# EAGLE design PICDevBoard-V1RevA (EAGLE 6.1)
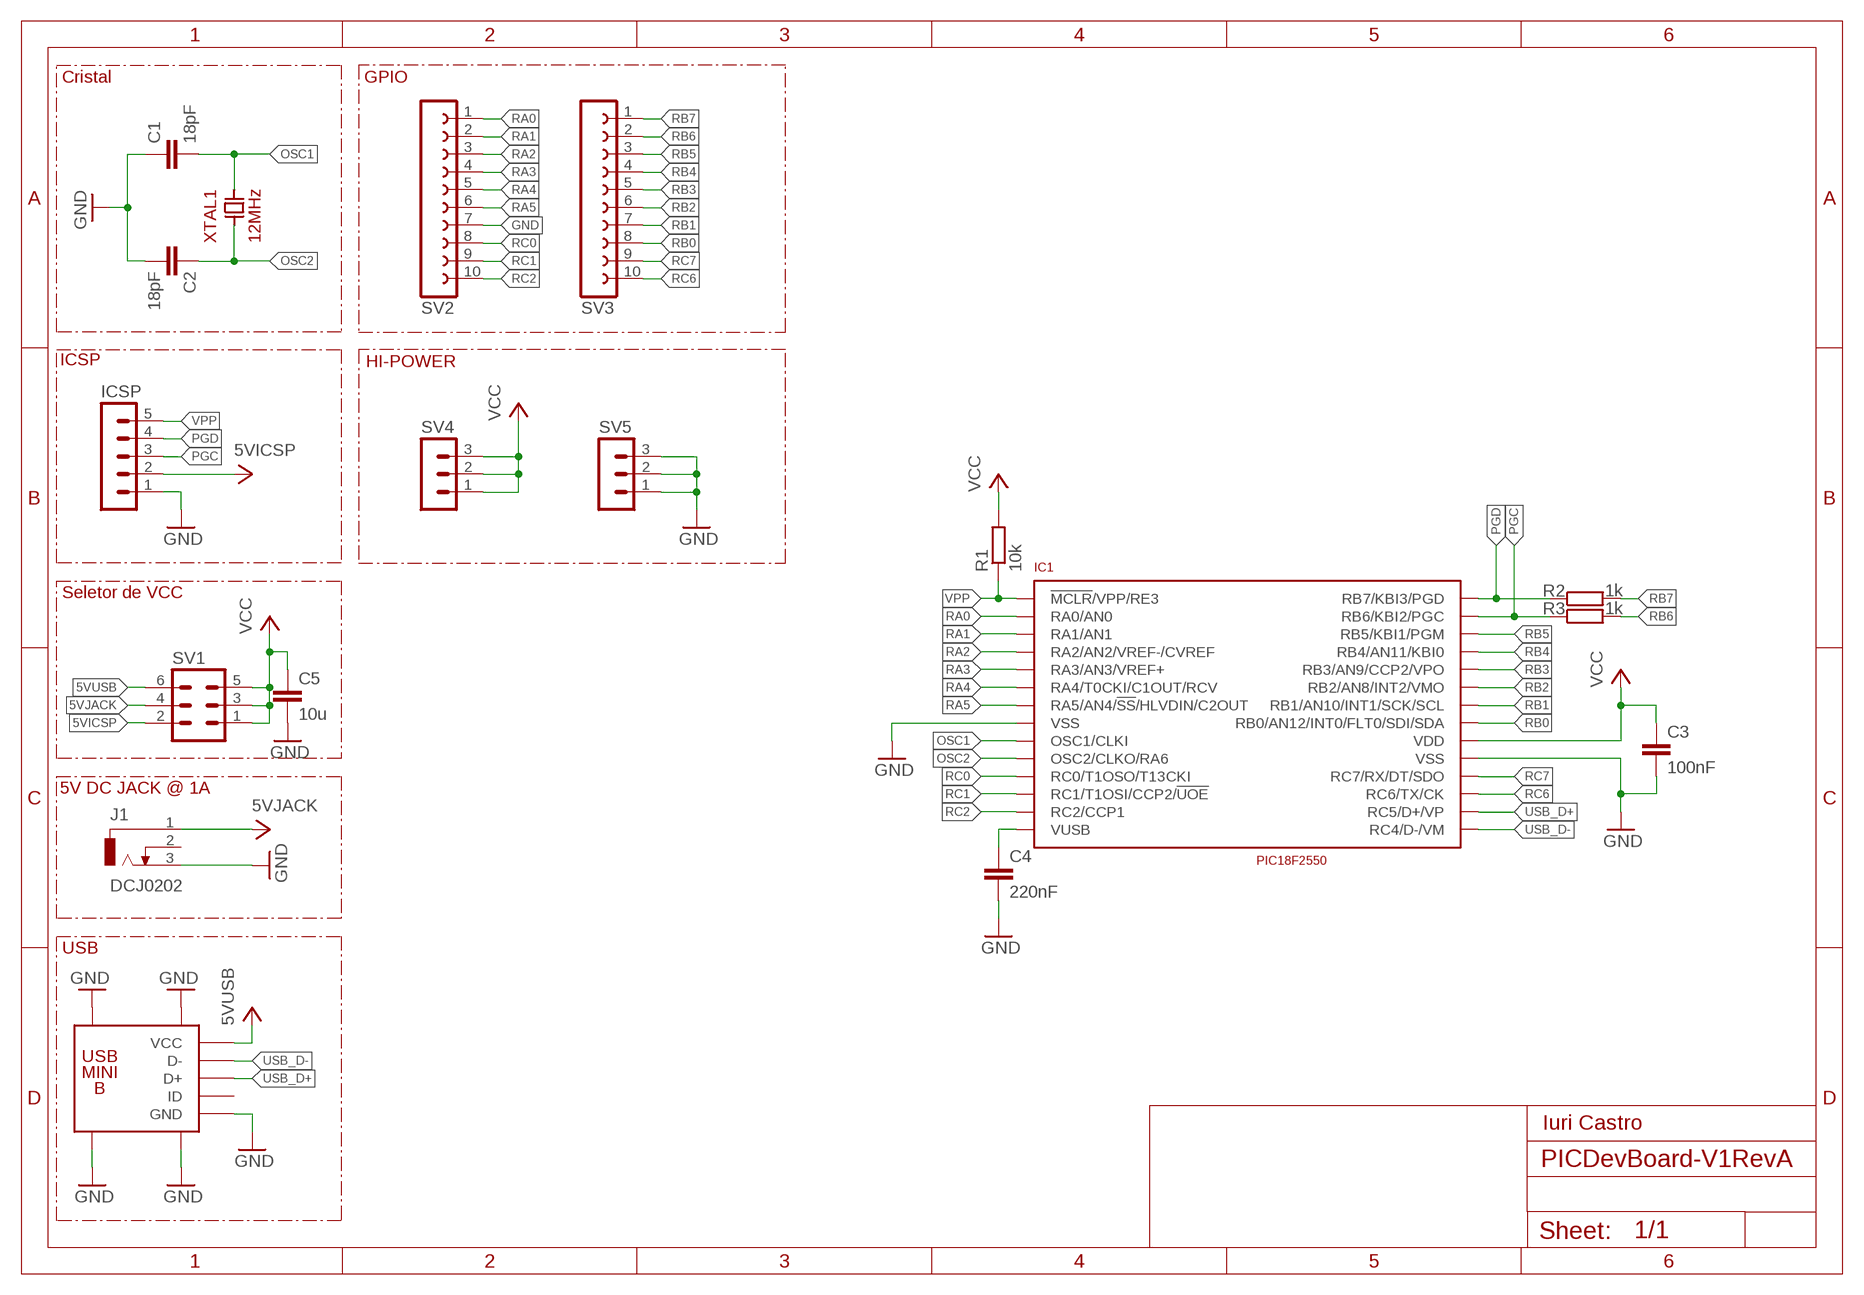
[diagram p0: schematic, sheet 1]

## Parts
C1  18pF  C-EUC0805  [C0805]
C2  18pF  C-EUC0805  [C0805]
C3  100nF  C-EUC0805  [C0805]
C4  220nF  C-EUC0805  [C0805]
C5  10u  C-EUC0805  [C0805]
IC1  PIC18F2550  [DIL28-3]
ICSP  MA05-1  [MA05-1]
J1  DCJ0202  [DCJ0202]
R1  10k  R-EU_R0805  [R0805]
R2  1k  R-EU_R0805  [R0805]
R3  1k  R-EU_R0805  [R0805]
SV1  MA03-2  [MA03-2]
SV2  FE10-1  [FE10]
SV3  FE10-1  [FE10]
SV4  MA03-1  [MA03-1]
SV5  MA03-1  [MA03-1]
USB1  USB-MINI-B  [DX2R005HN2E700]
XTAL1  12MHz  HC49-S  [HC49-S]

## Nets
5VICSP: ICSP.2 SV1.2
5VJACK: J1.1 SV1.4
5VUSB: SV1.6 USB1.P$1(VCC)
GND: C1.1 C2.2 C3.2 C4.2 C5.2 IC1.8(VSS) IC1.19(VSS) ICSP.1 J1.3 SV2.7 SV5.1 SV5.2 SV5.3 USB1.P$5(GND) USB1.P$6(GND) USB1.P$7(GND) USB1.P$8(GND) USB1.P$9(GND)
N$23: C4.1 IC1.14(VUSB)
OSC1: C1.2 IC1.9(OSC1/CLKI) XTAL1.P$2
OSC2: C2.1 IC1.10(OSC2/CLKO/RA6) XTAL1.P$1
PGC: IC1.27(RB6/KBI2/PGC) ICSP.3 R3.1
PGD: IC1.28(RB7/KBI3/PGD) ICSP.4 R2.1
RA0: IC1.2(RA0/AN0) SV2.1
RA1: IC1.3(RA1/AN1) SV2.2
RA2: IC1.4(RA2/AN2/VREF-/CVREF) SV2.3
RA3: IC1.5(RA3/AN3/VREF+) SV2.4
RA4: IC1.6(RA4/T0CKI/C1OUT/RCV) SV2.5
RA5: IC1.7(RA5/AN4/!SS!/HLVDIN/C2OUT) SV2.6
RB0: IC1.21(RB0/AN12/INT0/FLT0/SDI/SDA) SV3.8
RB1: IC1.22(RB1/AN10/INT1/SCK/SCL) SV3.7
RB2: IC1.23(RB2/AN8/INT2/VMO) SV3.6
RB3: IC1.24(RB3/AN9/CCP2/VPO) SV3.5
RB4: IC1.25(RB4/AN11/KBI0) SV3.4
RB5: IC1.26(RB5/KBI1/PGM) SV3.3
RB6: R3.2 SV3.2
RB7: R2.2 SV3.1
RC0: IC1.11(RC0/T1OSO/T13CKI) SV2.8
RC1: IC1.12(RC1/T1OSI/CCP2/!UOE) SV2.9
RC2: IC1.13(RC2/CCP1) SV2.10
RC6: IC1.17(RC6/TX/CK) SV3.10
RC7: IC1.18(RC7/RX/DT/SDO) SV3.9
USB_D+: IC1.16(RC5/D+/VP) USB1.P$3(D+)
USB_D-: IC1.15(RC4/D-/VM) USB1.P$2(D-)
VCC: C3.1 C5.1 IC1.20(VDD) R1.2 SV1.1 SV1.3 SV1.5 SV4.1 SV4.2 SV4.3
VPP: IC1.1(!MCLR!/VPP/RE3) ICSP.5 R1.1
Unconnected: J1.2 USB1.P$4(ID)

## Notes on the sheet
- Cristal | GPIO
- ICSP | HI-POWER
- Seletor de VCC
- 5V DC JACK @ 1A
- USB
- Iuri Castro

## Library data of the parts
C1-C5 = rcl:C-EU: CAPACITOR, European symbol
IC1 = PIC18F2550:PIC18F2550: PIC18F2550 Dip
ICSP = con-lstb:MA05-1: PIN HEADER; OC_FARNELL: unknown; OC_NEWARK: unknown
J1 = con-jack:DCJ0202: DC POWER JACK Source: DCJ0202.pdf; OC_FARNELL: unknown; OC_NEWARK: unknown
R1-R3 = rcl:R-EU_: RESISTOR, European symbol
SV1 = con-lstb:MA03-2: PIN HEADER; OC_FARNELL: unknown; OC_NEWARK: unknown
SV2 SV3 = con-lsta:FE10-1: FEMALE HEADER; OC_FARNELL: unknown; OC_NEWARK: unknown
SV4 SV5 = con-lstb:MA03-1: PIN HEADER; OC_FARNELL: unknown; OC_NEWARK: unknown
USB1 = USB:USB-MINI-B: CONN USB RCPT MINI B 5PS R/A SMD DX2R005HN2E700
XTAL1 = HC49-S:HC49-S: Crystal SMD

## Board
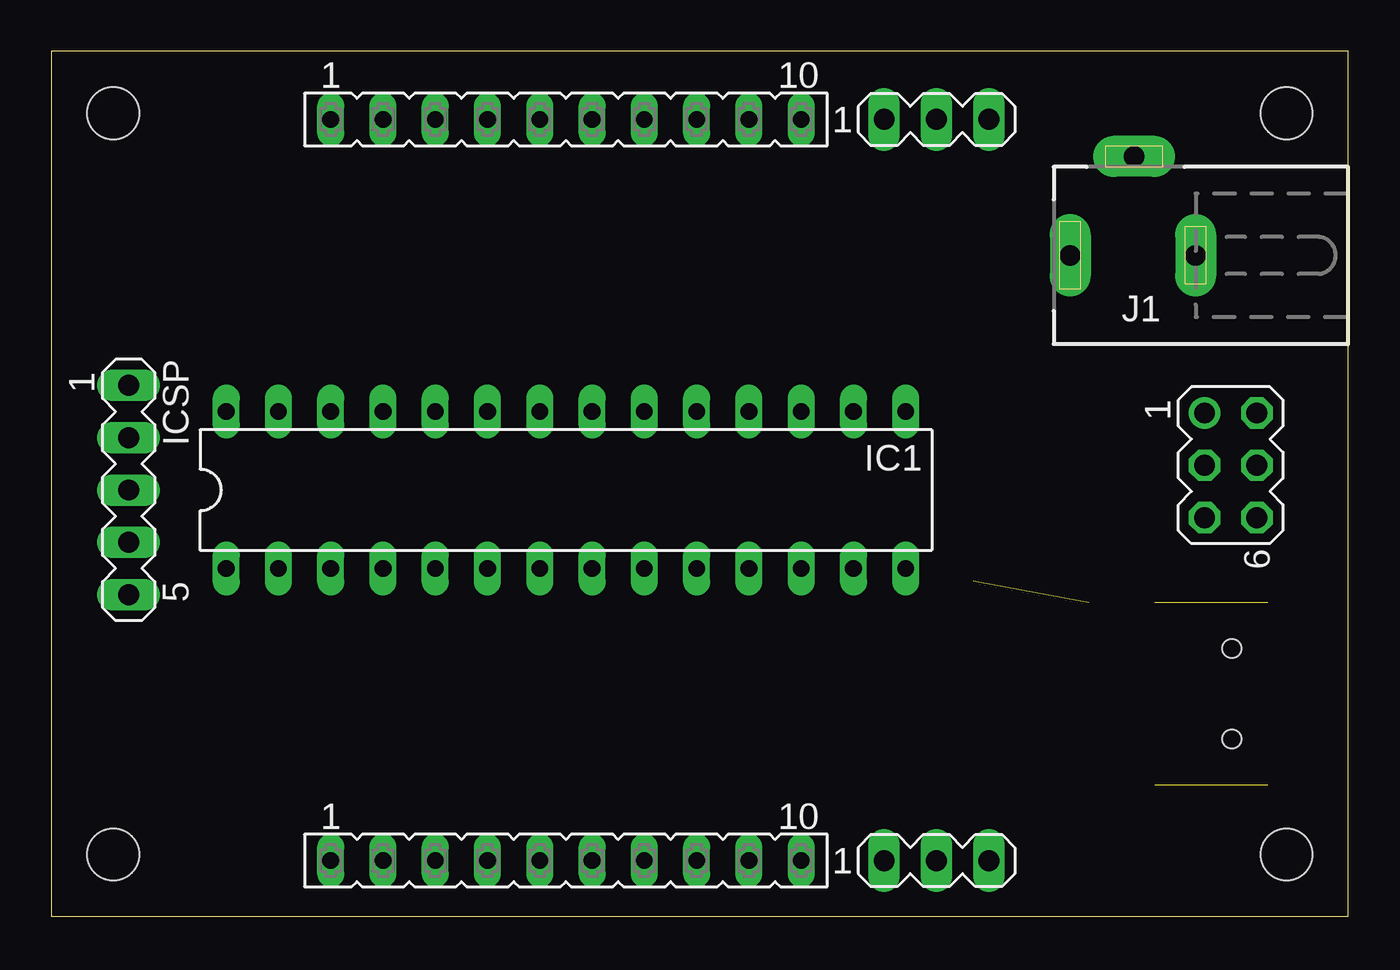
[diagram p1: board, top side]
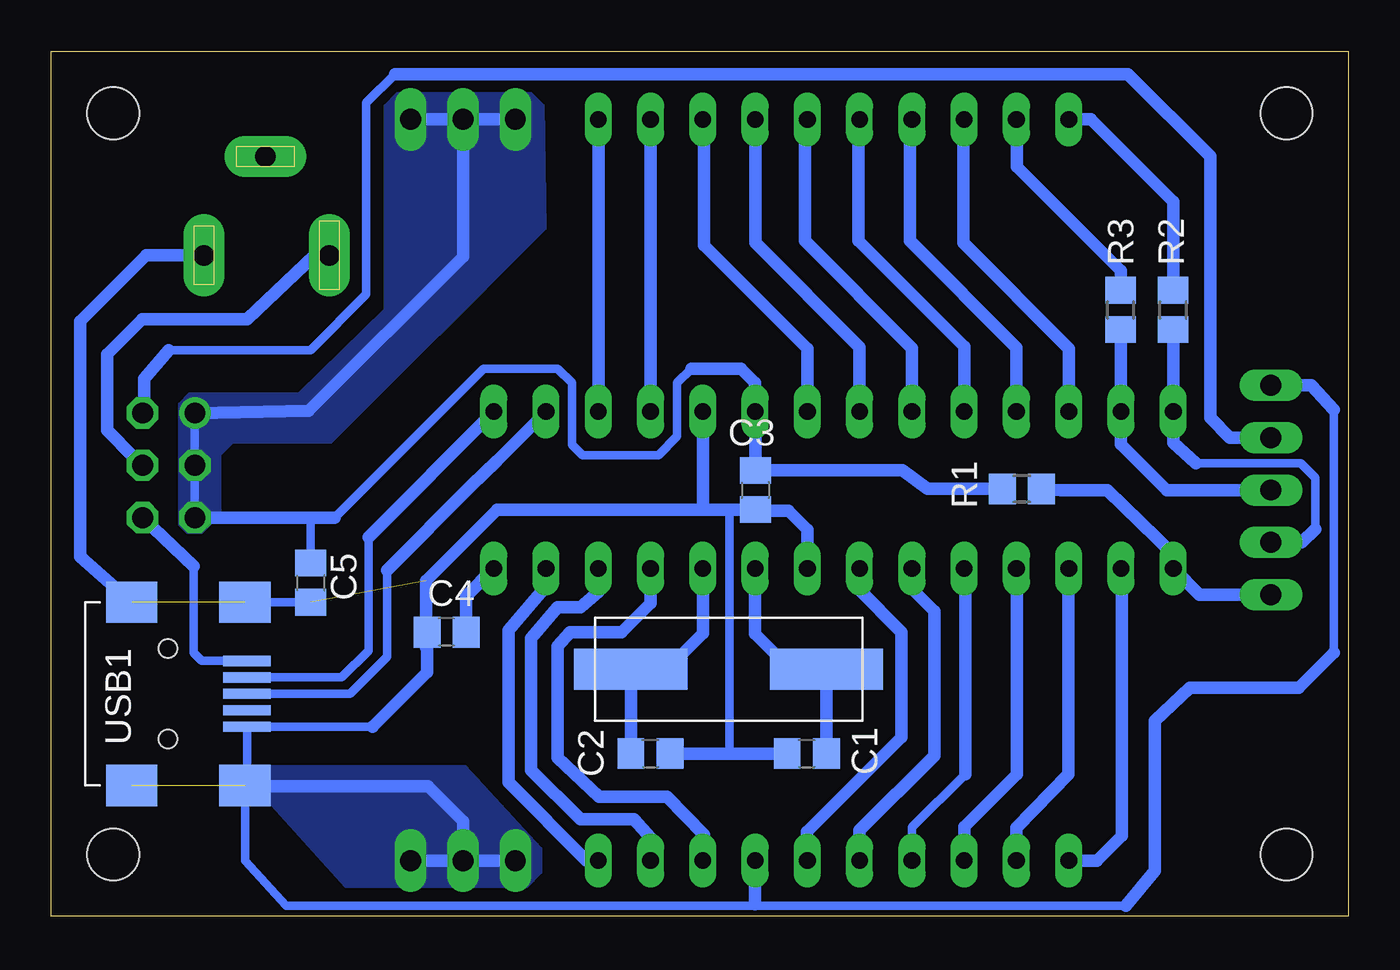
[diagram p2: board, bottom side, seen from below]

Size 63 x 42 mm. Coordinates in mm from the lower left corner, seen from the top.
Outline: 0,0 63,0 63,42 0,42 0,0
Copper layers (1*16): Top 0.035mm / dielectric 1.5mm / Bottom 0.035mm
Design rules: minimum track width 10mil, minimum drill 24mil, track to track 8mil, track to pad 8mil, pad to pad 8mil, via to via 8mil, smd to smd 8mil, copper to edge 40mil, drill to drill 8mil, minimum pad ring 10mil, minimum via ring 8mil, stop-mask expansion 4mil, vias tented up to drill 0mil, thermal gap 10mil
Holes 2.5 mm at 3,3 60,3 60,39 3,39

### Footprints (pad centres in the part's own frame; a part is rotated, then mirrored left to right if it is on the bottom)
C0805 = smd 1.3 x 1.5: 1 -0.95,0; 2 0.95,0
DIL28-3 = drill 0.813 long: 1 -16.51,-3.81; 2 -13.97,-3.81; 3 -11.43,-3.81; 4 -8.89,-3.81; 5 -6.35,-3.81; 6 -3.81,-3.81; 7 -1.27,-3.81; 8 1.27,-3.81; 9 3.81,-3.81; 10 6.35,-3.81; 11 8.89,-3.81; 12 11.43,-3.81; 13 13.97,-3.81; 14 16.51,-3.81; 15 16.51,3.81; 16 13.97,3.81; 17 11.43,3.81; 18 8.89,3.81; 19 6.35,3.81; 20 3.81,3.81; 21 1.27,3.81; 22 -1.27,3.81; 23 -3.81,3.81; 24 -6.35,3.81; 25 -8.89,3.81; 26 -11.43,3.81; 27 -13.97,3.81; 28 -16.51,3.81
MA05-1 = drill 1.016 long: 1 -5.08,0; 2 -2.54,0; 3 0,0; 4 2.54,0; 5 5.08,0
DCJ0202 = drill 1 pad 2 long: 1 0,3.1; 2 4.8,0; 3 0,-3
R0805 = smd 1.3 x 1.5: 1 -0.95,0; 2 0.95,0
MA03-2 = drill 1.016: 1 -2.54,-1.27 | drill 1.016 octagon: 2 -2.54,1.27; 3 0,-1.27; 4 0,1.27; 5 2.54,-1.27; 6 2.54,1.27
FE10 = drill 0.813 long: 1 -11.43,0; 2 -8.89,0; 3 -6.35,0; 4 -3.81,0; 5 -1.27,0; 6 1.27,0; 7 3.81,0; 8 6.35,0; 9 8.89,0; 10 11.43,0
MA03-1 = drill 1.016 long: 1 -2.54,0; 2 0,0; 3 2.54,0
DX2R005HN2E700 = smd 2.3 x 0.5: P$1 2.6,1.6; P$2 2.6,0.8; P$3 2.6,0; P$4 2.6,-0.8; P$5 2.6,-1.6 | smd 2.5 x 2: P$6 -3,4.45; P$7 2.5,4.45; P$8 -3,-4.45; P$9 2.5,-4.45 | hole 0.9: -1.25,2.2; -1.25,-2.2
HC49-S = smd 5.5 x 2: P$1 -4.75,0; P$2 4.75,0

### Placement (x,y rotation side)
C1  26.3,7.9 0 bottom
C2  33.9,7.9 0 bottom
C3  28.8,20.7 270 bottom
C4  43.8,13.8 180 bottom
C5  50.4,16.2 270 bottom
IC1  25,20.7 0 top
ICSP  3.75,20.7 270 top
J1  52.6,32.1 90 top
R1  15.85,20.75 180 bottom
R2  8.5,29.45 90 bottom
R3  11.05,29.45 90 bottom
SV1  57.3,21.9 270 top
SV2  25,2.7 0 top
SV3  25,38.7 0 top
SV4  43,38.7 0 top
SV5  43,2.7 0 top
USB1  56.1,10.8 0 bottom
XTAL1  30.1,12 0 bottom

### Tracks (layer width: path | path; a pad name or v marks a point on that pad's centre or on a via)
5VICSP
  Bottom 0.406: 46.3,40.9 47.7,39.5 47.7,30.2 50.4,27.5 57.3,27.5 | 58.5,24.51 SV1.2
  Bottom 0.61: 46.3,40.9 10.7,40.9 6.7,36.9 6.7,24.2 5.74,23.24 ICSP.2 | 57.3,27.5 58.5,26.1 58.5,24.51
5VJACK
  Bottom 0.406: SV1.4 59,22.3
  Bottom 0.61: 59,22.3 60.3,23.6 60.3,27.3 58.6,29 53.5,29 50.2,32.1 J1.1
5VUSB
  Bottom 0.406: USB1.P$1 55.7,12.4 56.1,12.8 56.1,16.99
  Bottom 0.61: 56.1,16.99 SV1.6
GND  (3 unrouted)
  Bottom 0.406: 28.75,19.7 C3.2 | 30.05,19.75 30.05,7.95 30.1,7.9 | 0.7,24.6 0.7,12.8 | 10.8,0.5 28.9,0.5 | USB1.P$9 53.5,6.15 USB1.P$5 47.4,9.2 | 28.81,0.59 28.9,0.5 | 31.35,19.8 31.3,19.75 | 28.9,0.5 51.6,0.5 53.6,2.7 USB1.P$9 | 52.65,6.3 USB1.P$9 | 44.8,13.05 C4.2 | C5.2 USB1.P$7
  Bottom 0.61: C1.1 30.1,7.9 C2.2 | IC1.8 26.27,18.77 27.2,19.7 28.75,19.7 | ICSP.1 1.78,25.78 0.7,24.6 | SV5.1 SV5.2 | SV5.2 SV5.3 | SV2.7 28.81,0.59 | 0.7,12.8 2.4,11.1 7.7,11.1 9.4,9.5 9.4,2.2 10.8,0.5 | C3.2 30.05,19.75 31.3,19.75 41.35,19.75 44.8,16.3 44.8,13.05 | IC1.19 31.35,19.8 | USB1.P$6 61.6,17.45 61.6,28.9 58.4,32.1 J1.3 | SV5.2 43,4.6 44.7,6.3 52.65,6.3 | C4.2 44.75,11.85 47.4,9.2
  pour Bottom (no thermals): 39.2,2.1 39.9,1.4 48.7,1.4 52.3,5.4 54.8,5.4 54.8,7.3 42.9,7.3 39.2,3.3
N$23
  Bottom 0.61: C4.1 42.85,15.55 IC1.14
OSC1
  Bottom 0.406: 27.1,12 XTAL1.P$2
  Bottom 0.61: XTAL1.P$2 C1.2 | IC1.9 28.81,13.71 27.1,12
OSC2
  Bottom 0.406: 33.1,12 XTAL1.P$1
  Bottom 0.61: XTAL1.P$1 C2.1 | IC1.10 31.35,13.75 33.1,12
PGC
  Bottom 0.406: 11.05,24.53 IC1.27
  Bottom 0.61: R3.1 11.05,24.53 | IC1.27 11.03,22.93 8.8,20.7 ICSP.3
PGD
  Bottom 0.406: IC1.28 | 1.6,18.8 1.6,21.3 2.3,22 7.4,22
  Bottom 0.61: R2.1 IC1.28 | ICSP.4 2.24,18.16 1.6,18.8 | 7.4,22 8.5,23 IC1.28
RA0
  Bottom 0.406: 11,16.86 IC1.2
  Bottom 0.61: 11,16.86 11,3.9 12.2,2.7 SV2.1
RA1
  Bottom 0.406: 13.6,16.82 IC1.3
  Bottom 0.61: SV2.2 16.11,4.29 13.6,6.9 13.6,16.82
RA2
  Bottom 0.406: IC1.4
  Bottom 0.61: SV2.3 18.65,4.35 16.1,6.9 IC1.4
RA3
  Bottom 0.406: SV2.4 21.19,4.31 18.6,6.9 | 18.6,16.84 IC1.5
  Bottom 0.61: 18.6,6.9 18.6,16.84
RA4
  Bottom 0.406: IC1.6
  Bottom 0.61: SV2.5 23.73,4.17 20.1,7.8 20.1,14.8 21.2,15.9 IC1.6
RA5
  Bottom 0.406: 23.8,16.82 IC1.7
  Bottom 0.61: SV2.6 26.3,4.1 21.7,8.7 21.7,13.8 23.8,15.9 23.8,16.82
RB0
  Bottom 0.406: 31.3,38.65 SV3.8
  Bottom 0.61: IC1.21 26.27,27.57 31.3,32.6 31.3,38.65
RB1
  Bottom 0.406: SV3.7
  Bottom 0.61: IC1.22 23.73,27.63 28.8,32.7 SV3.7
RB2
  Bottom 0.406: 26.4,38.57 SV3.6
  Bottom 0.61: IC1.23 21.19,27.59 26.4,32.8 26.4,38.57
RB3
  Bottom 0.406: 23.8,38.63 SV3.5
  Bottom 0.61: IC1.24 18.65,27.65 23.8,32.8 23.8,38.63
RB4
  Bottom 0.406: 21.3,38.59 SV3.4
  Bottom 0.61: IC1.25 16.11,27.61 21.3,32.8 21.3,38.59
RB5
  Bottom 0.406: 18.7,38.65 SV3.3
  Bottom 0.61: IC1.26 13.57,27.57 18.7,32.7 18.7,38.65
RB6
  Bottom 0.406: 11.01,30.44 R3.2
  Bottom 0.61: R3.2 11.05,31.35 16.1,36.4 SV3.2
RB7
  Bottom 0.406: 8.47,30.43 R2.2
  Bottom 0.61: R2.2 8.5,34.7 12.5,38.7 SV3.1
RC0
  Bottom 0.61: IC1.11 33.89,15.21 35.3,13.8 37.8,13.8 38.4,13.1 38.4,7.7 36.4,5.8 33.1,5.8 31.3,3.95 SV2.8
RC1
  Bottom 0.61: SV2.9 33.9,3.81 34.7,4.7 37.3,4.7 39.7,7.1 39.7,13.5 38.4,15 37.3,15 36.43,15.77 IC1.12
RC2
  Bottom 0.61: IC1.13 38.97,16.03 40.8,13.9 40.8,6.5 37,2.7 SV2.10
RC6
  Bottom 0.61: IC1.17 SV3.10
RC7
  Bottom 0.61: IC1.18 SV3.9
USB_D+
  Bottom 0.406: 46.7,16.8 46.7,12.6 48.5,10.8 USB1.P$3
  Bottom 0.61: 46.7,16.8 42.6,20.9 41.38,22.1 IC1.16
USB_D-
  Bottom 0.406: USB1.P$2 48.9,11.6 47.6,12.9 47.6,18.4 | IC1.15 41.51,24.49
  Bottom 0.61: 47.6,18.4 41.51,24.49
VCC
  Bottom 0.406: IC1.20 | SV1.1 SV1.3 SV1.5 55.97,19.3 | 31.9,26.6 32.6,25.9 32.6,23.3 33.5,22.4 37.2,22.4 37.7,22.9 37.7,25.9 38.4,26.6 42,26.6 49.24,19.36 | C5.1 50.4,19.26 50.5,19.36
  Bottom 0.61: IC1.20 C3.1 21.65,21.65 20.45,20.75 R1.2 | SV4.1 SV4.2 | SV4.2 SV4.3 | IC1.20 28.81,25.91 29.5,26.6 31.9,26.6 | SV1.1 50.5,24.54 43,32.04 SV4.2 | SV1.5 50.5,19.36 49.24,19.36
  pour Bottom (no thermals): 46.2,40 39.7,40 39.1,39.4 39,33.4 49.4,23 54.2,23 54.8,22.4 54.8,19.5 55.7,18.6 56.4,18.6 56.8,19 56.8,24.9 56.3,25.4 51,25.4 46.8,29.5 46.8,39.4
VPP
  Bottom 0.61: ICSP.5 7.22,15.62 IC1.1 8.49,17.59 11.7,20.7 13.95,20.7 R1.1

### Text on the board
Silk: 5V | VCC | HI-PWR | RB7 | RB6 | RB5 | RB4 | RB3 | RB2 | RB1 | RB0 | RC7 | RC6 | ICSP | ICSP | JACK | PIC18F2550 | USB | HI-PWR | GND | RA0 | RA1 | RA2 | RA3 | RA4 | RA5 | GND | RC0 | RC1 | RC2 | Rev. A | DevBoard